# EasyEDA schematic MAGIC-HOOVER-TRANS.json
TITLE: MAGIC-HOOVER TRANSMETTEUR; REV: 1.0; Date: 2024-09-28; Sheet: 1/1; Drawn By: SMHOSY; Company: ADS-L'atelier de SMHOSY
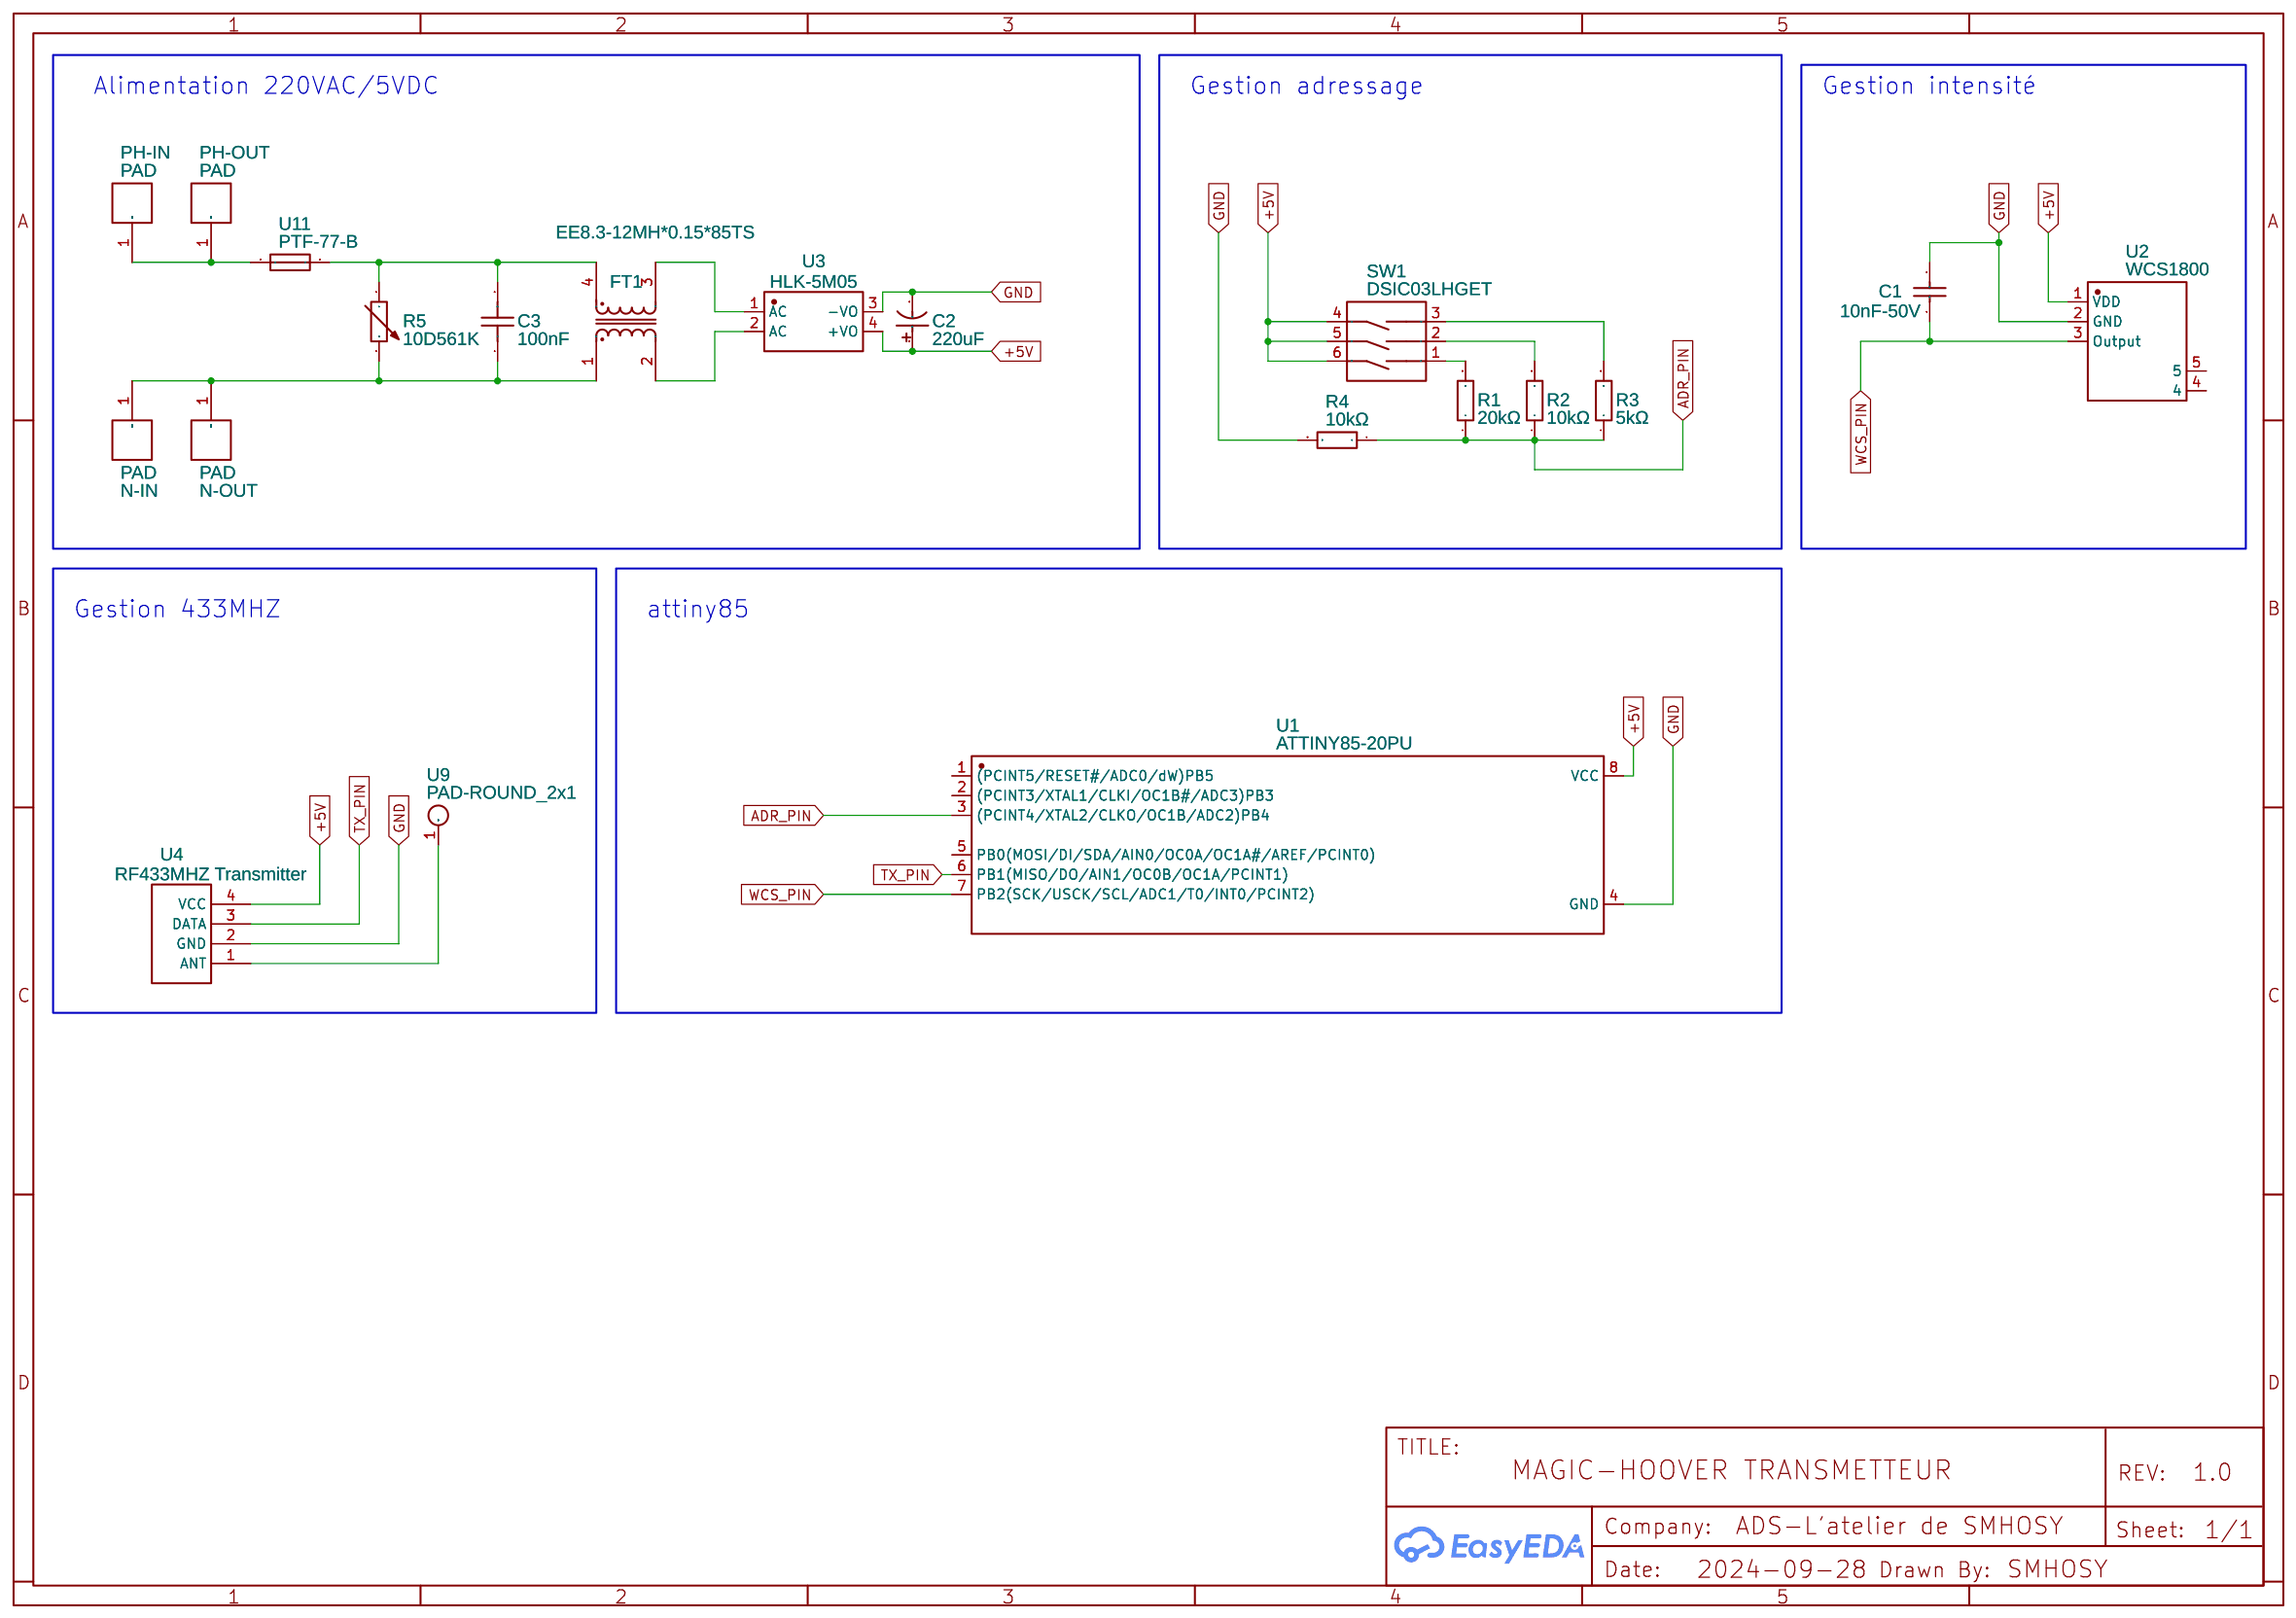
[diagram p0: schematic sheet]

## Parts
C1  10nF-50V  [C1206]
C2  220uF  [CAP-TH_BD5.0-P2.00-D0.8-FD]
C3  100nF  [CAP-TH_L18.0-W7.0-P15.00-D0.7]
FT1  EE8.3-12MH*0.15*85TS  [FILTER-TH_EE8.3-12MHX0.15X85TS]
N-IN  PAD  [PADPAD]
N-OUT  PAD  [PADPAD]
PH-IN  PAD  [PADPAD]
PH-OUT  PAD  [PADPAD]
R1  20kΩ  [R1206]
R2  10kΩ  [R1206]
R3  5kΩ  [R1206]
R4  10kΩ  [R1206]
R5  10D561K  [RES-TH_L13.0-W6.0-P7.50-D0.9-S6.00]
SW1  DSIC03LHGET  [SW-TH_6P-L9.2-W9.9-P2.54-LS7.6_2]
U1  ATTINY85-20PU  [PDIP-8_L9.3-W6.4-P2.54-LS7.9-BL-1]
U2  WCS1800  [SENSOR-TH_WCS1800]
U3  HLK-5M05  [PWRM-TH_HLK-5M05]
U4  RF433MHZ Transmitter  [RF433MHZ TRANSMITTER]
U9  PAD-ROUND_2x1  [PADPAD]
U11  PTF-77-B  [FUSE-TH_L25.2-W9.8_PTF-77-B]

## Library data of the parts
C1 = C1206X103K050T: Supplier: LCSC; Manufacturer: IHHEC(禾伸堂); Supplier Part: C106016; JLCPCB Part Class: Extended Part
C2 = 220uF 10V 5*11: Supplier: LCSC; Manufacturer: CX(承兴); Manufacturer Part: KM227M010D11RR0VH2FP0; Supplier Part: C43319; JLCPCB Part Class: Extended Part
C3 = X2-104K-275VAC_C914484: Contributor: lcsc; Supplier: LCSC; Supplier Part: C914484; Manufacturer: NDF(达孚); Manufacturer Part: X2-104K-275VAC; JLCPCB Part Class: Extended Part
FT1 = EE8.3-12MH*0.15*85TS: Supplier: LCSC; Supplier Part: C7437510; Manufacturer: 增益; Contributor: lcsc; JLCPCB Part Class: Extended Part
N-IN N-OUT PH-IN PH-OUT = PAD: Contributor: GURBUZ
R1 = PTFR1206B20K0P9: Contributor: LCSC; Supplier: LCSC; Supplier Part: C351480; Manufacturer: RESI(开步睿思); JLCPCB Part Class: Extended Part
R2-R4 = QR1206J10KP05: Contributor: LCSC; Supplier: LCSC; Supplier Part: C176266; Manufacturer: EVER OHMS(天二科技); Manufacturer Part: QR1206J10K0P05Z; JLCPCB Part Class: Extended Part
R5 = 10D561K: Supplier: LCSC; Manufacturer: HEL(鸿志); Supplier Part: C113236; JLCPCB Part Class: Extended Part
SW1 = DSIC03LHGET: Contributor: LCSC; Supplier: LCSC; Manufacturer: YE; Supplier Part: C57448; JLCPCB Part Class: Extended Part
U1 = ATTINY85-20PU: Contributor: LCSC; Supplier: LCSC; Supplier Part: C965497; Manufacturer: MICROCHIP(美国微芯); JLCPCB Part Class: Extended Part
U2 = WCS1800: Supplier: LCSC; Supplier Part: C9900070526; Manufacturer: null; Contributor: lcsc
U3 = HLK-5M05: Contributor: LCSC; Supplier: LCSC; Supplier Part: C209907; Manufacturer: HI-LINK(海凌科); JLCPCB Part Class: Extended Part
U4 = RF433MHZ Transmitter: Contributor: Abks_electronics
U9 = PAD-ROUND_2x1: Contributor: hippenium
U11 = PTF-77-B: Supplier: LCSC; Supplier Part: C22465955; Manufacturer: XFCN(兴飞); Contributor: lcsc; JLCPCB Part Class: Extended Part

## Nets
+5V: C2.1 SW1.4 SW1.5 SW1.6 U1.8(VCC) U2.1(VDD) U3.4(+VO) U4.4(VCC)
GND: C1.1 C2.2 R4.2 U1.4(GND) U2.2(GND) U3.3(-VO) U4.2(GND)
ADR_PIN: R1.1 R2.1 R3.1 R4.1 U1.3((PCINT4/XTAL2/CLKO/OC1B/ADC2)PB4)
TX_PIN: U1.6(PB1(MISO/DO/AIN1/OC0B/OC1A/PCINT1)) U4.3(DATA)
WCS_PIN: C1.2 U1.7(PB2(SCK/USCK/SCL/ADC1/T0/INT0/PCINT2)) U2.3(Output)
Net-(C3-1): C3.1 FT1.1 N-IN.1(PADPAD123) N-OUT.1(PADPAD123) R5.2
Net-(C3-2): C3.2 FT1.4 R5.1 U11.2
Net-(FT1-2): FT1.2 U3.2(AC)
Net-(FT1-3): FT1.3 U3.1(AC)
Net-(PH-IN-1): PH-IN.1(PADPAD123) PH-OUT.1(PADPAD123) U11.1
Net-(R1-2): R1.2 SW1.1
Net-(R2-2): R2.2 SW1.2
Net-(R3-2): R3.2 SW1.3
Net-(U4-1): U4.1(ANT) U9.1(Pad)

Not connected (* = marked no-connect by the designer): U1 1((PCINT5/RESET#/ADC0/dW)PB5) 2((PCINT3/XTAL1/CLKI/OC1B#/ADC3)PB3) 5(PB0(MOSI/DI/SDA/AIN0/OC0A/OC1A#/AREF/PCINT0)); U2 4 5

## Notes on the sheet
- Alimentation 220VAC/5VDC
- Gestion adressage
- Gestion intensité
- Gestion 433MHZ
- attiny85
